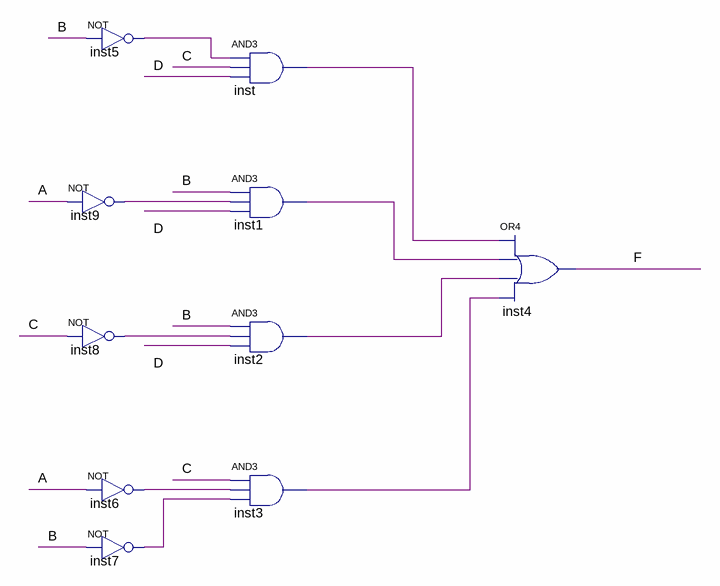
[diagram p0: schematic sheet]
// Quartus schematic prime.bdf as structural Verilog: 10 symbols, 0 pins
module prime (
);

  wire A, B, C, D, F, inst1_out, inst2_out, inst3_out, inst5_out, inst6_out, inst7_out, inst8_out, inst9_out,
       inst_out;

  not inst5 (inst5_out, B);
  not inst9 (inst9_out, A);
  not inst8 (inst8_out, C);
  not inst6 (inst6_out, A);
  not inst7 (inst7_out, B);
  and inst (inst_out, inst5_out, C, D);
  and inst1 (inst1_out, B, inst9_out, D);
  and inst2 (inst2_out, B, inst8_out, D);
  and inst3 (inst3_out, C, inst6_out, inst7_out);
  or inst4 (F, inst_out, inst1_out, inst2_out, inst3_out);
endmodule
